# EAGLE design boosterpack (EAGLE 7.1.0)
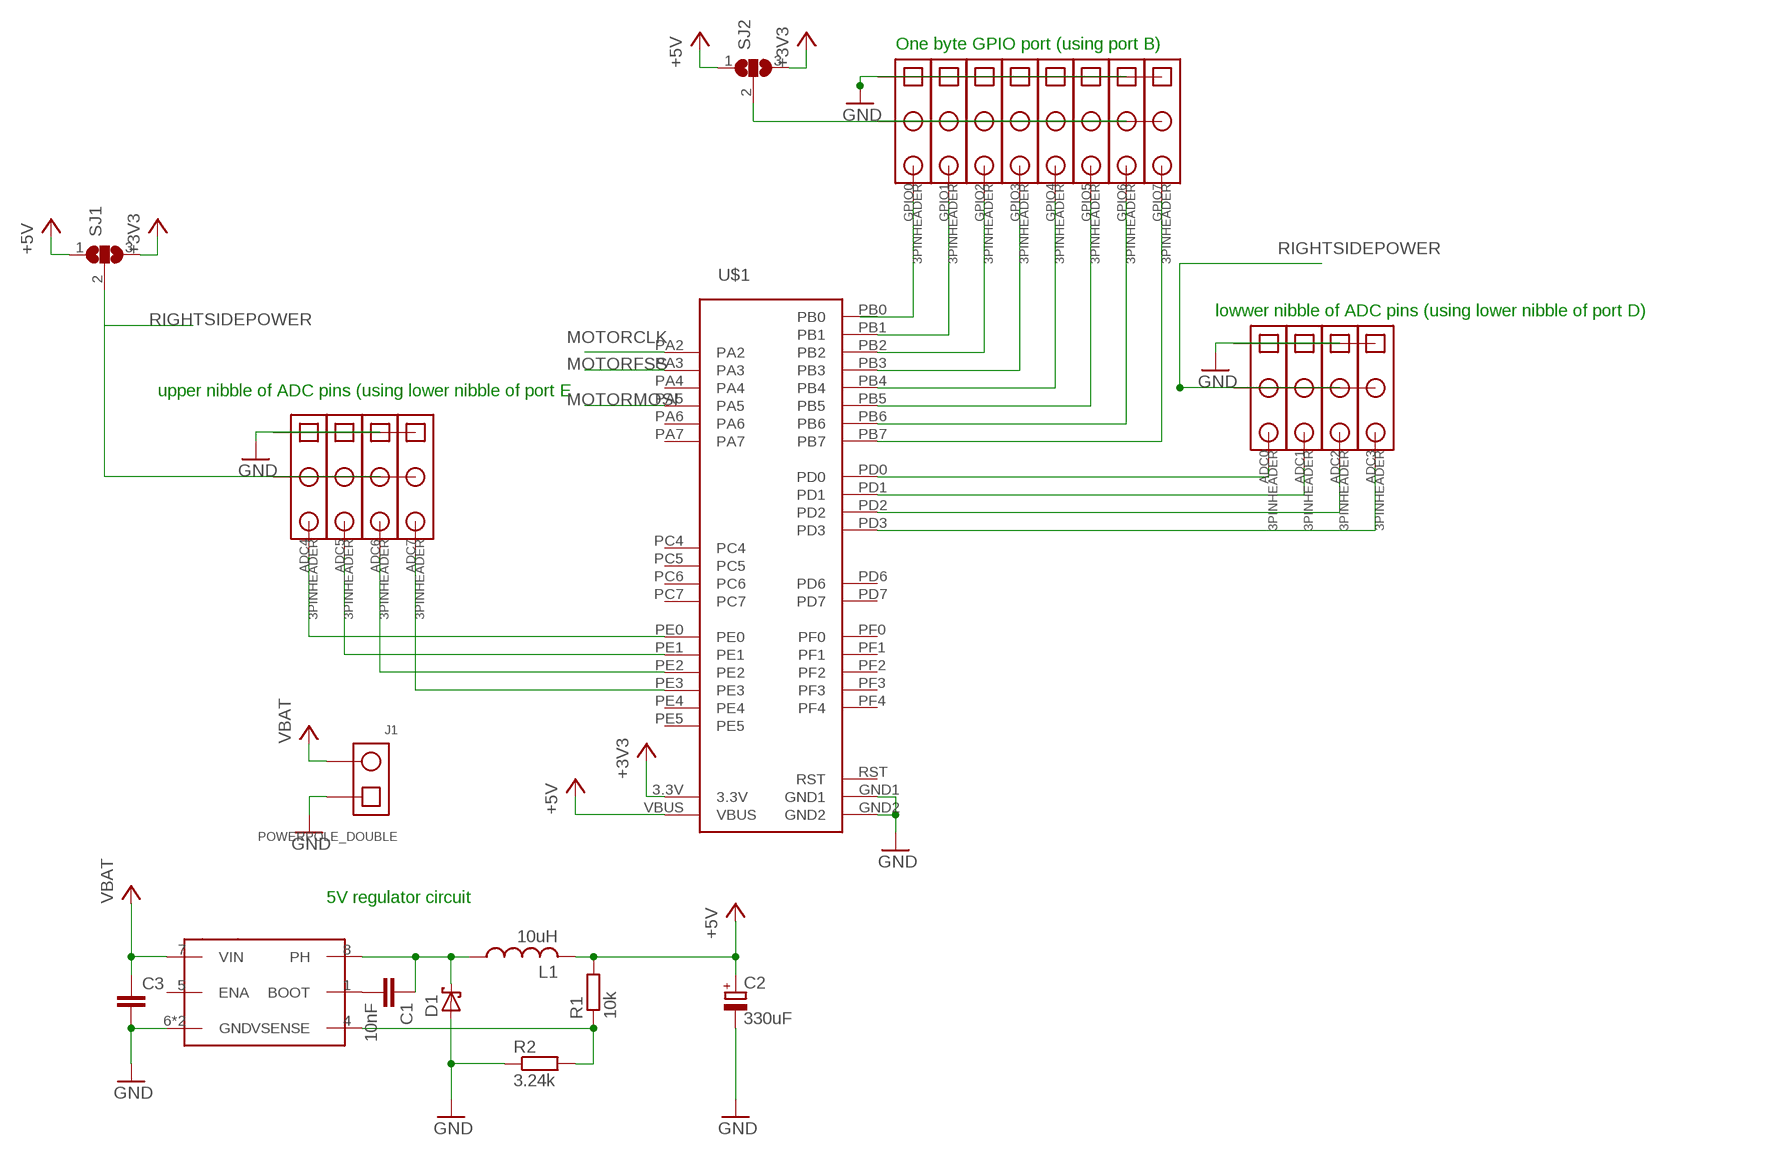
[diagram p0: schematic, sheet 1]

## Parts
ADC0  3PINHEADER  [3PINHEADER]
ADC1  3PINHEADER  [3PINHEADER]
ADC2  3PINHEADER  [3PINHEADER]
ADC3  3PINHEADER  [3PINHEADER]
ADC4  3PINHEADER  [3PINHEADER]
ADC5  3PINHEADER  [3PINHEADER]
ADC6  3PINHEADER  [3PINHEADER]
ADC7  3PINHEADER  [3PINHEADER]
C1  10nF  C-EU025-024X044  [C025-024X044]
C2  330uF  CPOL-EUB45181A  [B45181A]
C3  C-EU025-024X044  [C025-024X044]
D1  SCHOTTKY-DIODEDO35-7  [DO35-7]
GPIO0  3PINHEADER  [3PINHEADER]
GPIO1  3PINHEADER  [3PINHEADER]
GPIO2  3PINHEADER  [3PINHEADER]
GPIO3  3PINHEADER  [3PINHEADER]
GPIO4  3PINHEADER  [3PINHEADER]
GPIO5  3PINHEADER  [3PINHEADER]
GPIO6  3PINHEADER  [3PINHEADER]
GPIO7  3PINHEADER  [3PINHEADER]
J1  POWERPOLE_DOUBLE  [POWERPOLE_DOUBLE]
L1  10uH  SDR1006  [SDR1006]
R1  10k  R-EU_0204/5  [0204/5]
R2  3.24k  R-EU_0204/5  [0204/5]
SJ1  SJ2W  [SJ_2]
SJ2  SJ2W  [SJ_2]
U$1  STELLARIS-LAUNCHPADSTELLARIS-LAUNCHPAD-XL  [LAUNCHPAD-XL]
U$2  TPS5450  [DDS]

## Nets
+3V3: SJ1.3 SJ2.3 U$1.3.3V
+5V: C2.+ L1.P$2 R1.2 SJ1.1 SJ2.1 U$1.VBUS
ADC1: ADC1.3 U$1.PD1
ADC2: ADC2.3 U$1.PD2
ADC3: ADC3.3 U$1.PD3
ADC5: ADC5.3 U$1.PE1
GND: ADC0.1 ADC1.1 ADC2.1 ADC3.1 ADC4.1 ADC5.1 ADC6.1 ADC7.1 C2.- C3.2 D1.A GPIO0.1 GPIO1.1 GPIO2.1 GPIO3.1 GPIO4.1 GPIO5.1 GPIO6.1 GPIO7.1 J1.1 R2.1 U$1.GND1 U$1.GND2 U$2.6(GND) U$2.GROUNDPAD(GND)
GPIO0: GPIO0.3 U$1.PB0
GPIO1: GPIO1.3 U$1.PB1
GPIO2: GPIO2.3 U$1.PB2
GPIO3: GPIO3.3 U$1.PB3
MOTORCLK: U$1.PA2
MOTORFSS: U$1.PA3
MOTORMOSI: U$1.PA5
N$1: ADC0.3 U$1.PD0
N$2: GPIO4.3 U$1.PB4
N$3: GPIO5.3 U$1.PB5
N$4: ADC6.3 U$1.PE2
N$5: ADC7.3 U$1.PE3
N$6: GPIO6.3 U$1.PB6
N$7: GPIO0.2 GPIO1.2 GPIO2.2 GPIO3.2 GPIO4.2 GPIO5.2 GPIO6.2 GPIO7.2 SJ2.2
N$8: GPIO7.3 U$1.PB7
N$9: C1.2 U$2.1(BOOT)
N$10: R1.1 R2.2 U$2.4(VSENSE)
N$11: C1.1 D1.C L1.P$1 U$2.8(PH)
N$13: ADC4.3 U$1.PE0
RIGHTSIDEPOWER: ADC0.2 ADC1.2 ADC2.2 ADC3.2 ADC4.2 ADC5.2 ADC6.2 ADC7.2 SJ1.2
VCC: C3.1 J1.2 U$2.7(VIN) ; supply symbol labelled VBAT
Unconnected: U$1.PA4 U$1.PA6 U$1.PA7 U$1.PC4 U$1.PC5 U$1.PC6 U$1.PC7 U$1.PD6 U$1.PD7 U$1.PE4 U$1.PE5 U$1.PF0 U$1.PF1 U$1.PF2 U$1.PF3 U$1.PF4 U$2.5(ENA)

## Notes on the sheet
- One byte GPIO port (using port B)
- lowwer nibble of ADC pins (using lower nibble of port D)
- upper nibble of ADC pins (using lower nibble of port E
- 5V regulator circuit

## Power pins joined to a net without a drawn wire
RST: U$1.RST

## Library data of the parts
ADC0 ADC1-ADC7 GPIO0 GPIO1-GPIO7 = RASEagleLib:3PINHEADER: 3 Pin Header 0.1" Headers
C1 C3 = resistor:C-EU: CAPACITOR, European symbol
C2 = resistor:CPOL-EU: POLARIZED CAPACITOR, European symbol
D1 = diode:SCHOTTKY-DIODE: Schottky Diode
J1 = RASEagleLib:POWERPOLE_DOUBLE: Double PowerPole Connector Good for battery connections.
L1 = RASEagleLib:SDR1006
R1 R2 = resistor:R-EU_: RESISTOR, European symbol
SJ1 SJ2 = jumper:SJ2W: SMD solder JUMPER
U$1 = StellarisLaunchPad_Fred:STELLARIS-LAUNCHPAD
U$2 = packages(ti):TPS5450

## Board
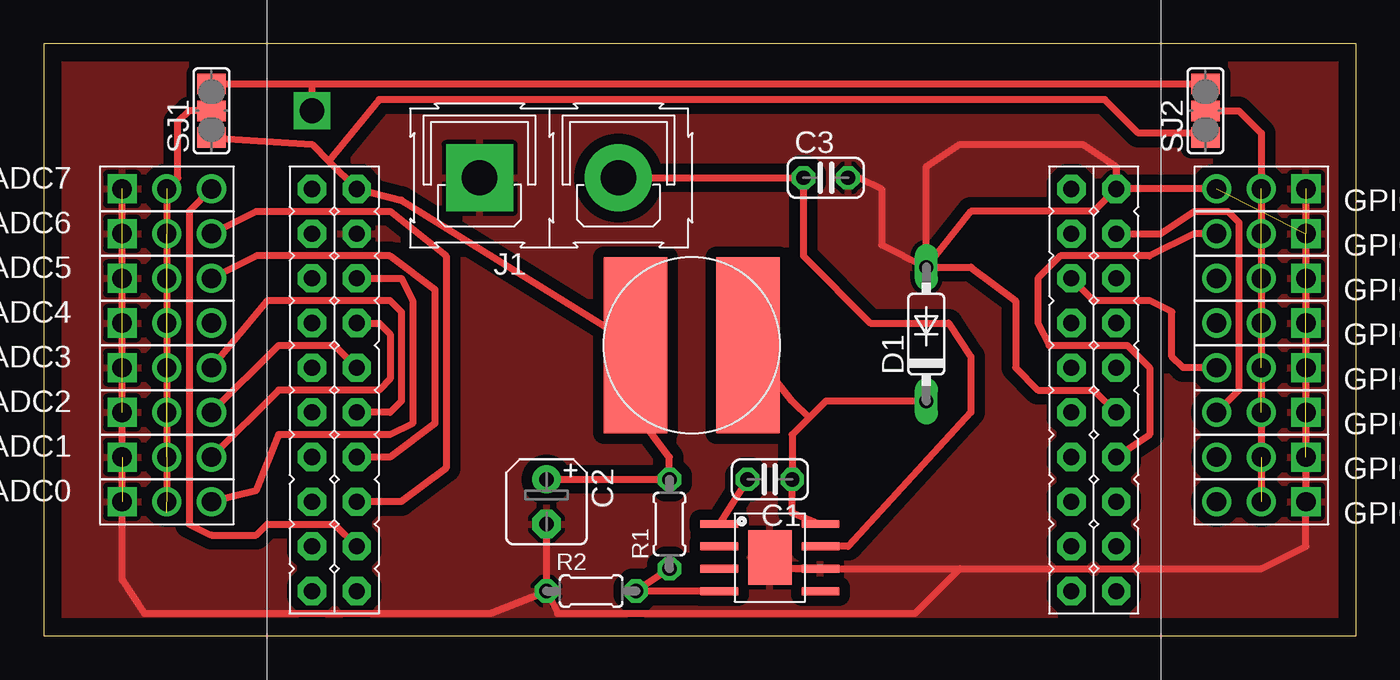
[diagram p1: board, top side]
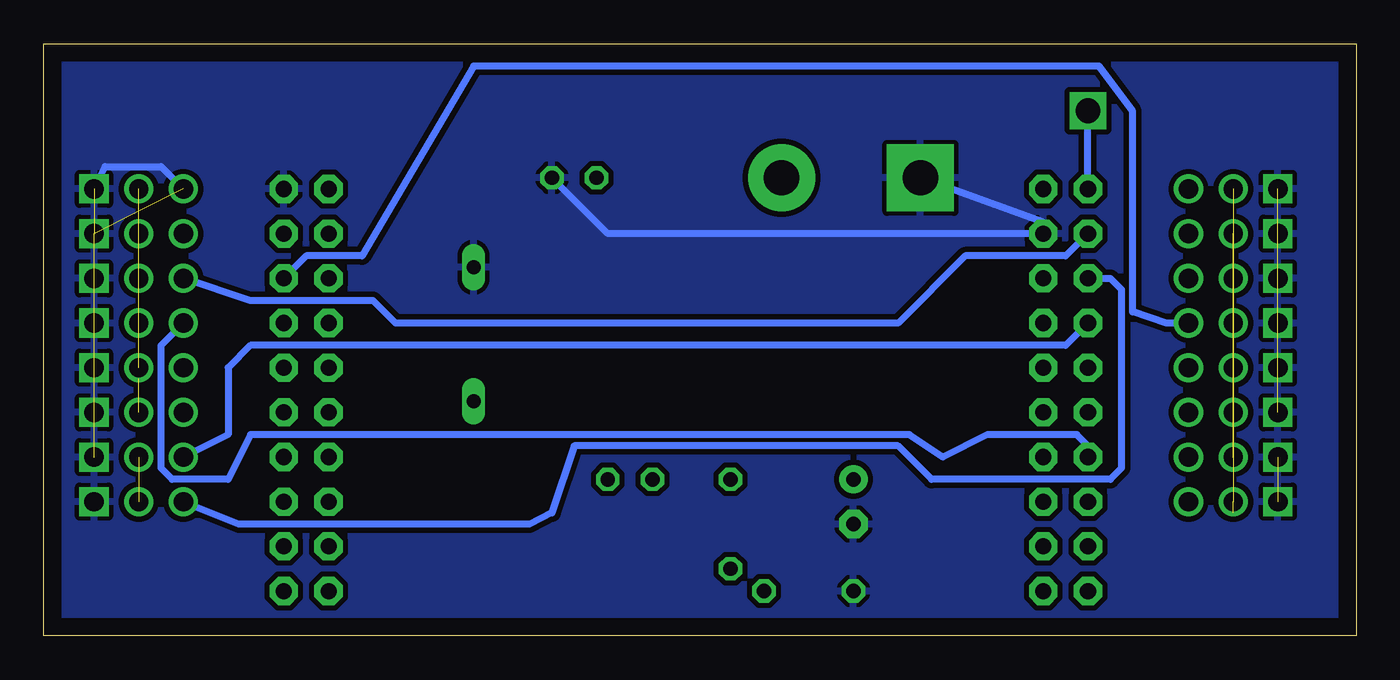
[diagram p2: board, bottom side, seen from below]

Size 74.6 x 33.65 mm. Coordinates in mm from the lower left corner, seen from the top.
Outline: 0,0 74.6,0 74.6,33.65 0,33.65 0,0
Copper layers (1*16): Top 0.035mm / dielectric 1.5mm / Bottom 0.035mm
Design rules "default": minimum track width 10mil, minimum drill 24mil, track to track 8mil, track to pad 8mil, pad to pad 8mil, via to via 8mil, smd to smd 8mil, copper to edge 40mil, drill to drill 8mil, minimum pad ring 10mil, minimum via ring 8mil, stop-mask expansion 4mil, vias tented up to drill 0mil, thermal gap 10mil

### Footprints (pad centres in the part's own frame; a part is rotated, then mirrored left to right if it is on the bottom)
3PINHEADER = drill 1.1 square: 1 0,0 | drill 1.1: 2 2.54,0; 3 5.08,0
C025-024X044 = drill 0.813 octagon: 1 -1.27,0; 2 1.27,0
B45181A = drill 0.813 pad 1.6: + -1.27,0 | drill 0.813 pad 1.6 octagon: - 1.27,0
DO35-7 = drill 0.813 long: A 3.81,0; C -3.81,0
POWERPOLE_DOUBLE = drill 2 pad 3.81 square: 1 0,0 | drill 2 pad 3.81: 2 7.9,0
SDR1006 = smd 10 x 3.6: P$1 0,3.2; P$2 0,-3.2
0204/5 = drill 0.813 octagon: 1 -2.54,0; 2 2.54,0
SJ_2 = smd 1.168 x 1.6: 1 -1.524,0; 2 0,0; 3 1.524,0
LAUNCHPAD-XL = drill 0.914 pad 1.6 octagon: 3.3V 30.48,2.54; GND1 33.02,5.08; GND2 30.48,48.26; PA2 53.34,48.26; PA3 50.8,48.26; PA4 48.26,48.26; PA5 48.26,2.54; PA6 50.8,2.54; PA7 53.34,2.54; PB0 35.56,2.54; PB1 38.1,2.54; PB2 33.02,48.26; PB3 35.56,45.72; PB4 45.72,2.54; PB5 33.02,2.54; PB6 45.72,48.26; PB7 43.18,48.26; PC4 38.1,45.72; PC5 40.64,45.72; PC6 43.18,45.72; PC7 45.72,45.72; PD0 35.56,5.08; PD1 38.1,5.08; PD2 40.64,5.08; PD3 43.18,5.08; PD6 48.26,45.72; PD7 50.8,45.72; PE0 35.56,48.26; PE1 45.72,5.08; PE2 48.26,5.08; PE3 50.8,5.08; PE4 40.64,2.54; PE5 43.18,2.54; PF0 38.1,48.26; PF1 53.34,5.08; PF2 30.48,45.72; PF3 33.02,45.72; PF4 53.34,45.72; RST 40.64,48.26; VBUS 30.48,5.08
DDS = smd 2.15 x 0.45: 1 -2.875,1.905; 2 -2.875,0.635; 3 -2.875,-0.635; 4 -2.875,-1.905; 5 2.875,-1.905; 6 2.875,-0.635; 7 2.875,0.635; 8 2.875,1.905 | smd 2.49 x 3.1: GROUNDPAD 0,0

### Placement (x,y rotation side)
ADC0  4.45,7.62 0 top
ADC1  4.45,10.16 0 top
ADC2  4.45,12.7 0 top
ADC3  4.45,15.24 0 top
ADC4  4.45,17.78 0 top
ADC5  4.45,20.32 0 top
ADC6  4.45,22.86 0 top
ADC7  4.45,25.4 0 top
C1  41.28,8.89 180 top
C2  28.57,7.62 270 top
C3  44.45,26.04 0 top
D1  50.17,17.14 90 top
GPIO0  71.76,7.62 180 top
GPIO1  71.76,10.16 180 top
GPIO2  71.76,12.7 180 top
GPIO3  71.76,15.24 180 top
GPIO4  71.76,17.78 180 top
GPIO5  71.76,20.32 180 top
GPIO6  71.76,22.86 180 top
GPIO7  71.76,25.4 180 top
J1  24.76,26.04 0 top
L1  36.83,16.51 270 top
R1  35.56,6.35 90 top
R2  31.11,2.54 0 top
SJ1  9.52,29.84 90 top
SJ2  66.04,29.84 90 top
U$1  12.7,55.88 270 top
U$2  41.28,4.45 0 top

### Tracks (layer width: path | path; a pad name or v marks a point on that pad's centre or on a via)
+3V3  (via drill 1.4 pad 1.27)
  Top 0.406: SJ2.3 15.24,31.37 | 15.24,31.37 SJ1.3 | v15.24,29.84 15.24,31.37
  Bottom 0.406: U$1.3.3V v15.24,29.84
+5V
  Top 0.406: C2.+ R1.2 35.56,10.16 33.66,12.7 L1.P$2 20.32,24.77 U$1.VBUS 16.19,26.99 | SJ1.1 15.24,27.94 16.19,26.99 | SJ2.1 65.79,28.57 62.23,28.57 60.33,30.48 19.05,30.48 16.19,26.99
ADC1
  Top 0.406: U$1.PD1 19.05,17.78 19.68,17.14 19.68,14.6 19.05,13.97 13.34,13.97 ADC1.3
ADC2
  Top 0.406: ADC2.3 13.34,16.51 16.51,16.51 U$1.PD2
ADC3
  Top 0.406: ADC3.3 12.7,19.05 19.68,19.05 20.32,18.41 20.32,13.34 19.68,12.7 U$1.PD3
ADC5
  Top 0.406: ADC5.3 12.07,21.59 19.68,21.59 22.22,19.68 22.22,12.06 19.68,10.16 U$1.PE1
GND  (13 unrouted)
  Top 0.406: R2.1 C2.- | ADC7.1 ADC0.1 4.45,3.17 5.71,1.27 25.4,1.27 R2.1 | GPIO7.1 GPIO0.1 71.76,5.08 69.22,3.81 52.07,3.81 | U$2.GROUNDPAD 41.28,3.81 U$2.6 52.07,3.81 | C3.2 46.36,26.04 47.62,25.4 47.62,22.23 D1.A 50.17,26.67 52.07,27.94 59.06,27.94 60.96,26.67 U$1.GND2 | R2.1 29.21,1.27 49.53,1.27 52.07,3.81
  Bottom 0.406: C3.2 42.55,22.86 U$1.GND1 17.78,23.49 J1.1 | GPIO7.1 71.12,26.67 67.95,26.67 66.67,25.4
  pour Top (isolate 0.61): 0,33.65 0,0 74.93,0 74.93,33.65
  pour Bottom (isolate 0.305): 0,33.65 74.93,33.65 74.93,0 0,0
GPIO0
  Bottom 0.406: U$1.PB0 13.97,20.32 13.34,19.68 13.34,9.52 13.97,8.89 24.13,8.89 26.04,10.8 44.45,10.8 45.72,6.98 46.99,6.35 63.5,6.35 GPIO0.3
GPIO1
  Bottom 0.406: U$1.PB1 16.51,16.51 62.87,16.51 64.14,15.24 64.14,11.43 GPIO1.3
GPIO2
  Top 0.406: U$1.PB2 63.5,22.86 65.41,24.13 67.31,24.13 67.95,23.49 67.95,13.97 GPIO2.3
GPIO3
  Top 0.406: GPIO3.3 64.77,15.24 64.14,15.88 64.14,18.41 62.87,19.05 59.69,19.05 U$1.PB3
N$1
  Top 0.406: U$1.PD0 20.32,20.32 20.95,19.05 20.95,12.06 19.68,11.43 13.34,11.43 12.07,8.25 ADC0.3
N$2
  Bottom 0.406: GPIO4.3 67.95,16.51 67.95,9.52 67.31,8.89 64.14,8.89 62.87,11.43 25.4,11.43 23.5,10.16 20.95,11.43 15.88,11.43 15.24,10.8 U$1.PB4
N$3
  Bottom 0.406: U$1.PB5 16.51,21.59 22.22,21.59 26.04,17.78 54.61,17.78 55.88,19.05 62.87,19.05 GPIO5.3
N$4
  Top 0.406: ADC6.3 12.07,24.13 19.68,24.13 22.86,21.59 22.86,9.52 20.32,7.62 U$1.PE2
N$5
  Top 0.406: ADC7.3 8.25,24.13 8.25,6.35 9.52,5.71 12.07,5.71 12.7,6.35 16.51,6.35 U$1.PE3
N$6
  Top 0.406: GPIO6.3 65.41,22.86 62.87,21.59 57.78,21.59 56.52,20.32 56.52,17.78 57.15,16.51 61.59,16.51 62.87,15.24 62.87,11.43 U$1.PB6
N$7  (6 unrouted)
  Top 0.406: SJ2.2 67.95,29.84 69.22,28.57 GPIO3.2 69.22,14.6 GPIO0.2
N$8
  Top 0.406: GPIO7.3 60.96,25.4 59.69,24.13 52.7,24.13 50.17,20.95 52.7,20.95 55.25,19.05 55.25,15.24 56.52,13.97 59.69,13.97 U$1.PB7
N$9
  Top 0.406: C1.2 U$2.1
N$10
  Top 0.406: R1.1 R2.2 U$2.4
N$11
  Top 0.406: U$2.8 42.55,6.98 C1.1 42.55,11.43 43.5,12.38 | L1.P$1 42.55,13.34 43.5,12.38 | D1.C 44.45,13.34 43.5,12.38
N$13
  Bottom 0.406: ADC4.3 10.79,17.78 12.7,18.41 12.7,29.84 14.61,32.38 50.17,32.38 56.52,21.59 59.69,21.59 U$1.PE0
RIGHTSIDEPOWER  (8 unrouted)
  Top 0.406: SJ1.2 8.25,29.84 7.62,29.21 7.62,26.04 ADC7.2 6.98,6.98
VCC
  Top 0.406: J1.2 C3.1 43.18,21.59 46.99,17.78 51.44,17.78 52.7,15.88 52.7,12.7 45.72,5.08 U$2.7

### Text on the board
tOrigins: 3V3 | 3V3 | 5V | 5V | Port D | 0 | 0 | 1 | 1 | 2 | 2 | 3 | 3 | 0 | 4 | 1 | 5 | 2 | 6 | 3 | 7 | Port E | Ground | Power | Signal | Signal | Power | Ground | Port B